# EAGLE design 5VACDC (EAGLE 9.6.2)
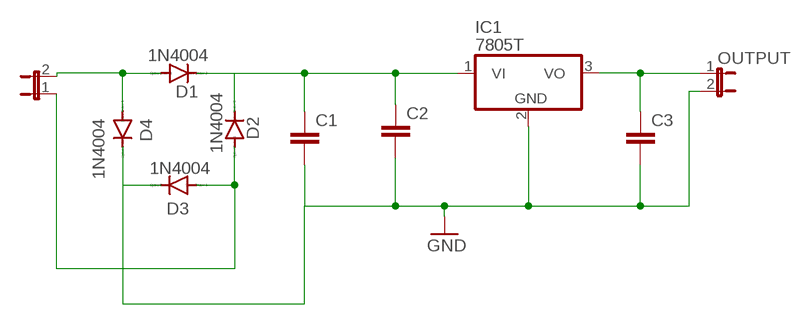
[diagram p0: schematic, sheet 1]

## Parts
C1  C2,5-3  [C2.5-3]
C2  C2,5-3  [C2.5-3]
C3  C2,5-3  [C2.5-3]
D1  1N4004  [DO41-10]
D2  1N4004  [DO41-10]
D3  1N4004  [DO41-10]
D4  1N4004  [DO41-10]
IC1  7805T  [TO220H]
INPUT  JP1E  [JP1]
OUTPUT  JP1E  [JP1]

## Nets
GND: C1.2 C2.2 C3.2 D3.C D4.C IC1.2(GND) OUTPUT.2
N$1: D1.A D4.A INPUT.2
N$2: C1.1 C2.1 D1.C D2.C IC1.1(VI)
N$4: D2.A D3.A INPUT.1
N$5: C3.1 IC1.3(VO) OUTPUT.1

## Library data of the parts
C1-C3 = capacitor-wima:C: CAPACITOR naming: grid - package width
D1-D4 = diode:1N4004: DIODE general purpose rectifier, 1 A
IC1 = linear:78*: Positive VOLTAGE REGULATOR Source: http://cache.national.com/ds/LM/LM78L05.pdf http://www.fairchildsemi.com/ds/LM/LM7805.pdf
INPUT OUTPUT = jumper:JP1E: JUMPER

## Board
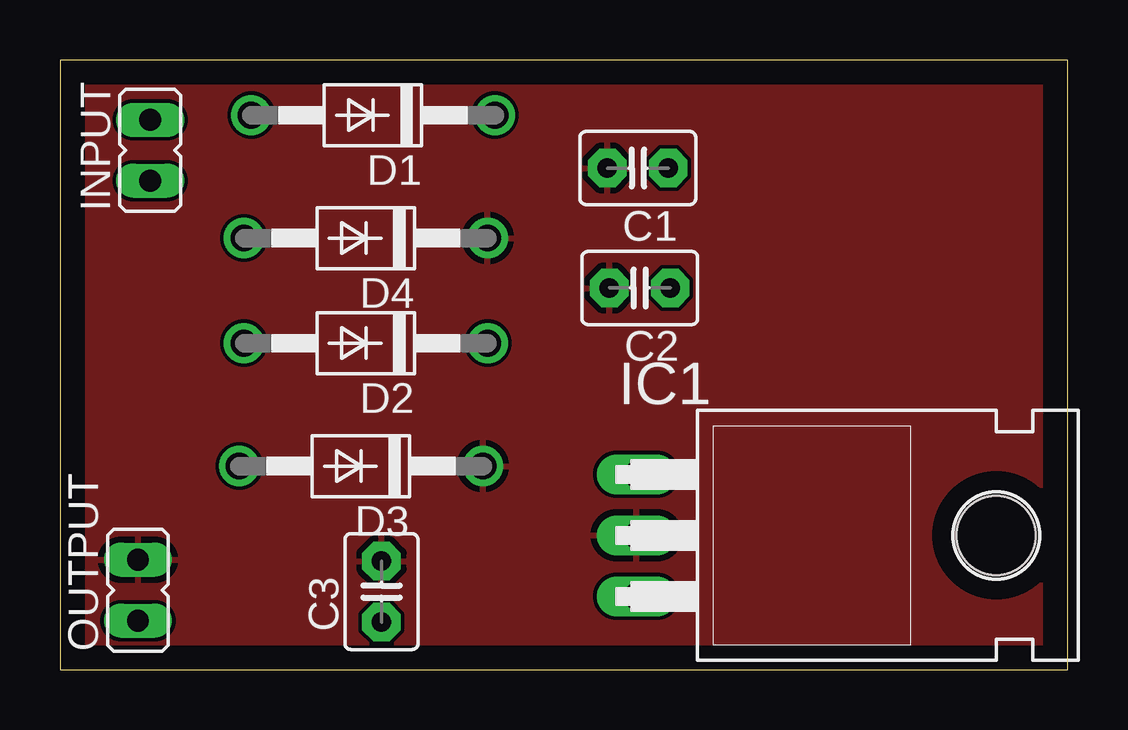
[diagram p1: board, top side]
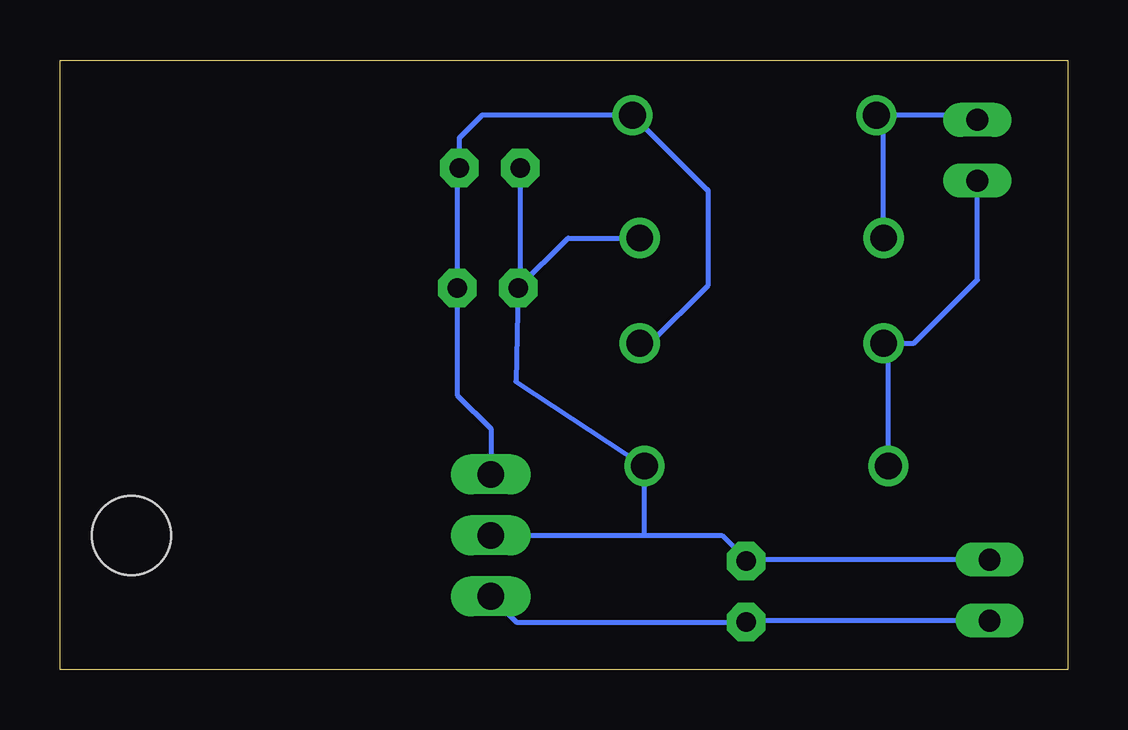
[diagram p2: board, bottom side, seen from below]

Size 42 x 25.4 mm. Coordinates in mm from the lower left corner, seen from the top.
Outline: 0,0 42,0 42,25.4 0,25.4 0,0
Copper layers (1*16): Top 0.035mm / dielectric 1.5mm / Bottom 0.035mm
Design rules "default": minimum track width 6mil, minimum drill 0.35mm, track to track 6mil, track to pad 6mil, pad to pad 6mil, via to via 6mil, smd to smd 6mil, copper to edge 40mil, drill to drill 6mil, minimum pad ring 10mil, minimum via ring 8mil, stop-mask expansion 4mil, vias tented up to drill 0mil, thermal gap 10mil

### Footprints (pad centres in the part's own frame; a part is rotated, then mirrored left to right if it is on the bottom)
C2.5-3 = drill 0.813 pad 1.6 octagon: 1 -1.27,0; 2 1.27,0
DO41-10 = drill 1.118: A 5.08,0; C -5.08,0
TO220H = drill 1.118 long: 1 -2.54,-10.16; 2 0,-10.16; 3 2.54,-10.16 | hole 3.302: 0,4.826
JP1 = drill 0.914 long: 1 0,-1.27; 2 0,1.27

### Placement (x,y rotation side)
C1  24.09,20.9 180 top
C2  24.17,15.9 180 top
C3  13.4,3.25 90 top
D1  13.05,23.1 180 top
D2  12.75,13.6 180 top
D3  12.55,8.48 180 top
D4  12.75,17.98 180 top
IC1  34.2,5.59 270 top
INPUT  3.76,21.64 0 top
OUTPUT  3.25,3.31 0 top

### Tracks (layer width: path | path; a pad name or v marks a point on that pad's centre or on a via)
GND
  Bottom 0.2: C1.2 22.82,15.98 C2.2 | C2.2 20.82,17.98 D4.C | C2.2 23,12 D3.C 17.63,5.59 | OUTPUT.2 13.4,4.58 | 13.4,4.58 C3.2 | IC1.2 18,5.59 17.63,5.59 | 17.63,5.59 14.41,5.59 13.4,4.58
  pour Top: 43,-0.5 43,26 42,26 -0.5,26 -0.5,25 -0.5,-0.5 0.5,-0.5
N$1
  Top 0.152: INPUT.2 3.95,23.1
  Bottom 0.2: INPUT.2 3.95,23.1 D1.A 7.67,22.8 D4.A
N$2
  Bottom 0.2: IC1.1 24.04,10.04 25.44,11.44 C2.1 25.44,20.82 C1.1 25.36,22.14 24.4,23.1 D1.C 15.03,20 15,20 15,16 17.4,13.6 D2.C
N$4
  Bottom 0.2: D3.A 7.47,13.4 D2.A 6.4,13.6 3.76,16.24 INPUT.1
N$5
  Bottom 0.2: OUTPUT.1 13.34,2.04 C3.1 22.97,1.98 IC1.3